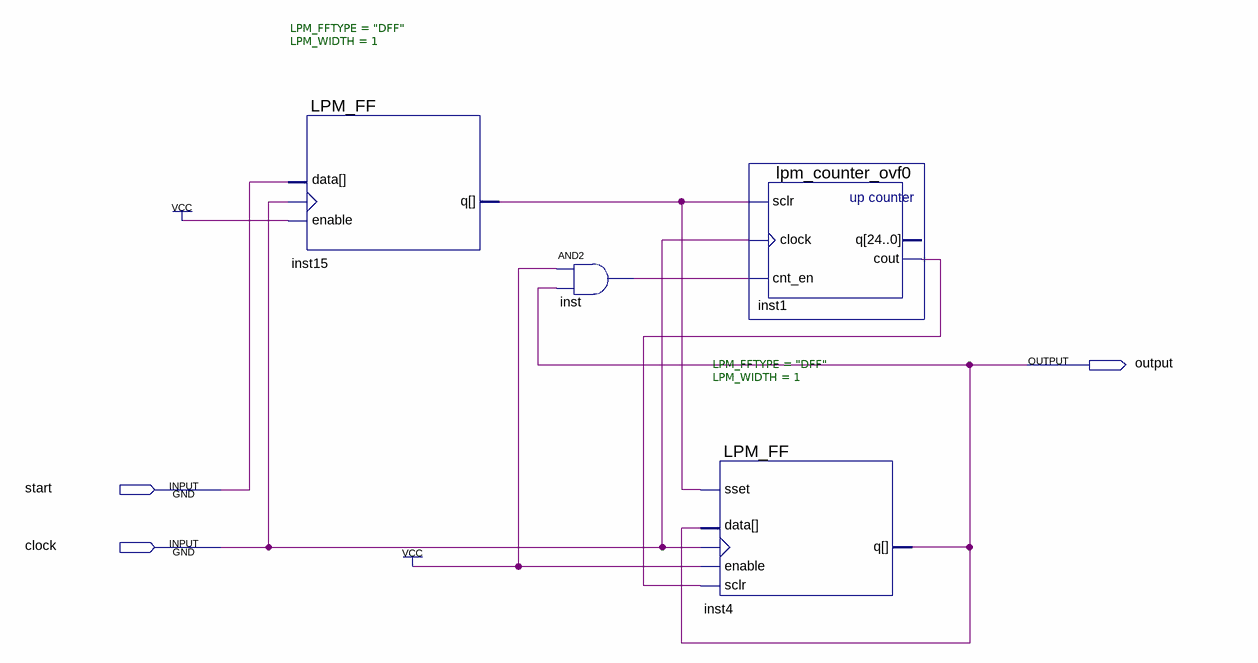
[diagram p0: schematic sheet]
// Quartus schematic monoflop_ovf.bdf as structural Verilog: 4 symbols, 3 pins
module monoflop_ovf (
  input  start,
  input  clock,
  output \output 
);

  wire inst1_cout, inst15_q, inst_out;

  LPM_FF #(.LPM_FFTYPE("DFF"), .LPM_WIDTH(1)) inst15 (.enable(1'b1), .clock(clock), .data(start), .q(inst15_q));
  and inst (inst_out, 1'b1, \output );
  LPM_FF #(.LPM_FFTYPE("DFF"), .LPM_WIDTH(1)) inst4 (
    .clock(clock), .data(\output ), .enable(1'b1), .sclr(inst1_cout), .sset(inst15_q), .q(\output ));
  lpm_counter_ovf0 inst1 (.sclr(inst15_q), .clock(clock), .cnt_en(inst_out), .cout(inst1_cout));  // open: q
endmodule
